# EAGLE design boardV2 (EAGLE 6.4)
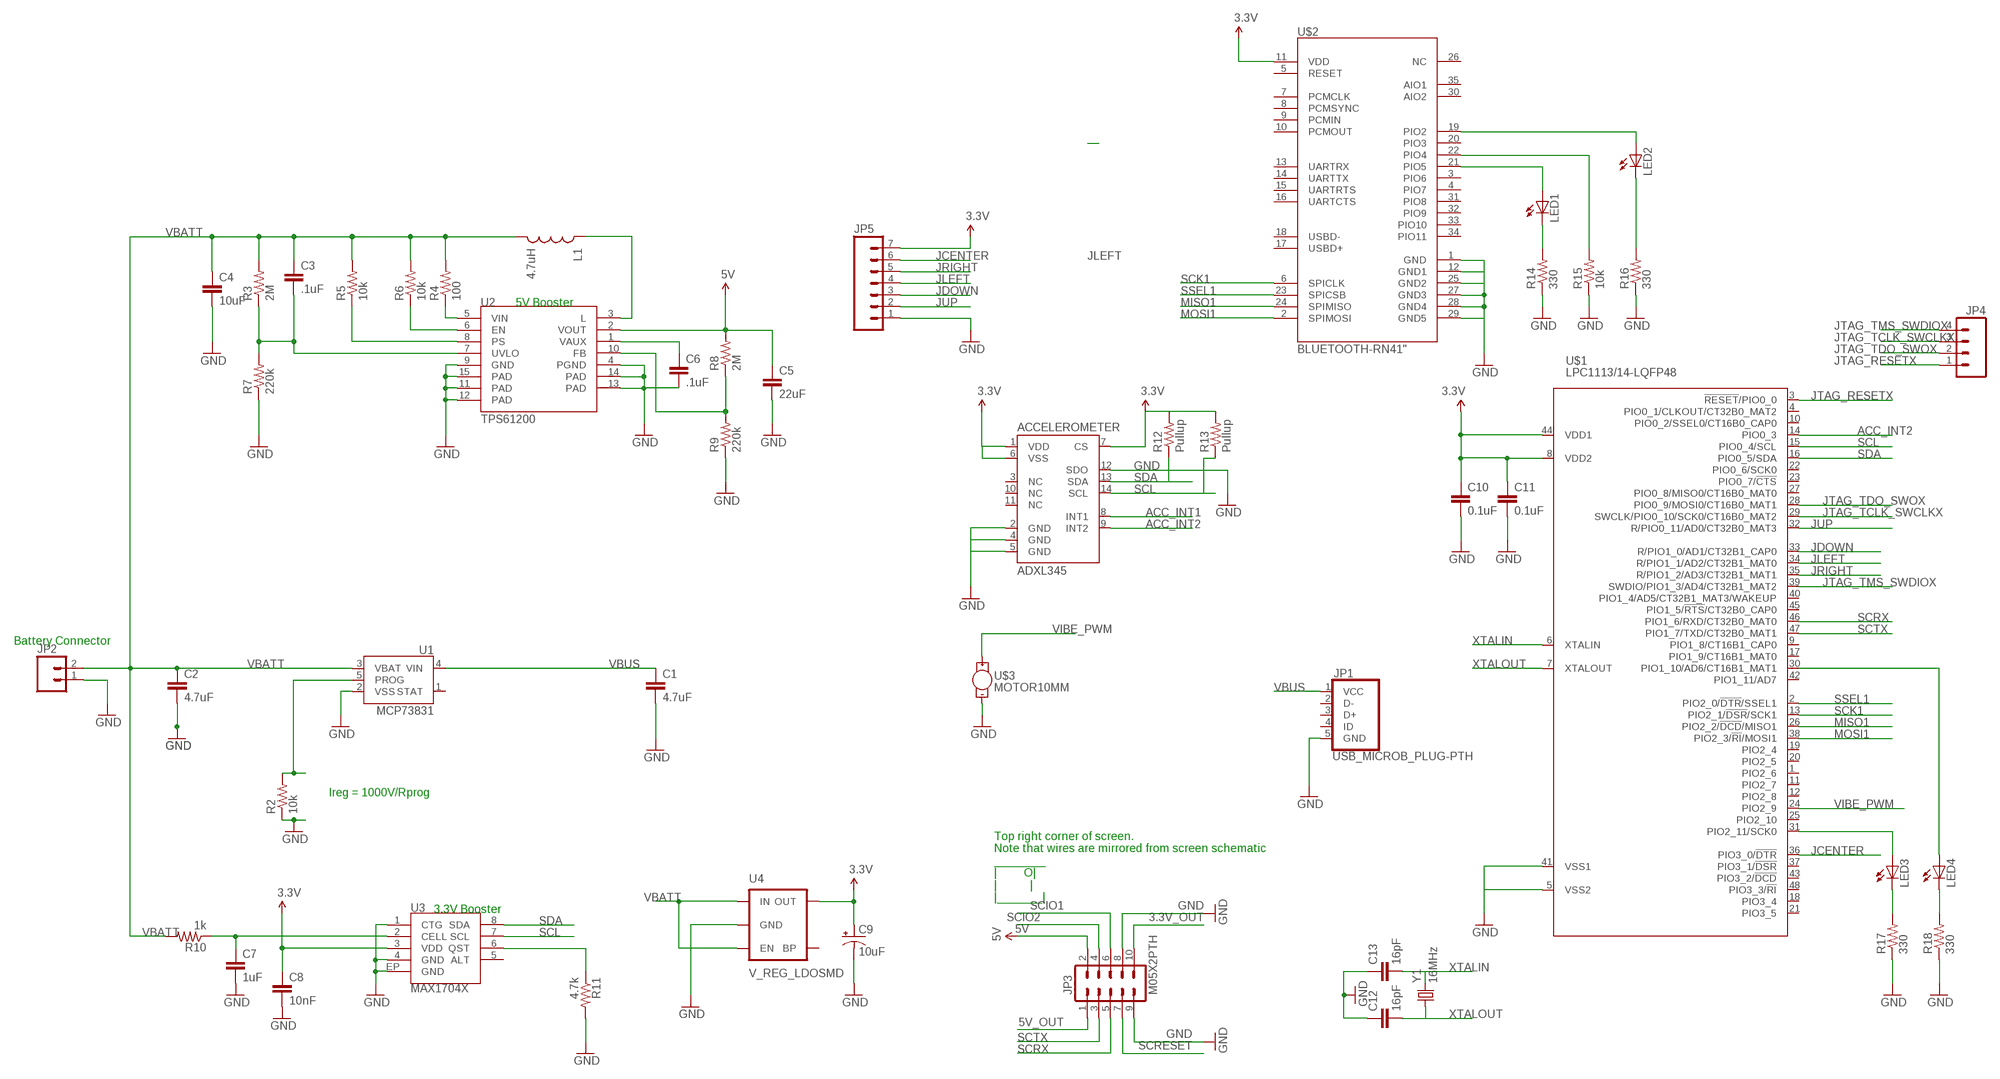
[diagram p0: schematic, sheet 1]

## Parts
ACCELEROMETER  ADXL345  [LGA14]
C1  4.7uF  CAP0402-CAP  [0402-CAP]
C2  4.7uF  CAP0402-CAP  [0402-CAP]
C3  .1uF  CAP0402-CAP  [0402-CAP]
C4  10uF  CAP0402-CAP  [0402-CAP]
C5  22uF  CAP0402-CAP  [0402-CAP]
C6  .1uF  CAP0402-CAP  [0402-CAP]
C7  1uF  CAP0402-CAP  [0402-CAP]
C8  10nF  CAP0402-CAP  [0402-CAP]
C9  10uF  10UF-TANT  [EIA3216]
C10  0.1uF  .1UF-CER  [0402-CAP]
C11  0.1uF  .1UF-CER  [0402-CAP]
C12  16pF  CAP0402-CAP  [0402-CAP]
C13  16pF  CAP0402-CAP  [0402-CAP]
JP1  USB_MICROB_PLUG-PTH  [MICRO-B-RA-TH]
JP2  M02-JST-2-PTH-NO_SILK  [JST-2-PTH-NS]
JP3  M05X2PTH  [AVR_ICSP]
JP4  M04POLAR  [MOLEX-1X4]
JP5  M07  [1X07]
L1  4.7uH  INDUCTOR0402  [C0402]
LED1  LED0603  [LED-0603]
LED2  LED0603  [LED-0603]
LED3  LED0603  [LED-0603]
LED4  LED0603  [LED-0603]
R2  10k  RESISTOR0402-RES  [0402-RES]
R3  2M  RESISTOR0402-RES  [0402-RES]
R4  100  RESISTOR0402-RES  [0402-RES]
R5  10k  RESISTOR0402-RES  [0402-RES]
R6  10k  RESISTOR0402-RES  [0402-RES]
R7  220k  RESISTOR0402-RES  [0402-RES]
R8  2M  RESISTOR0402-RES  [0402-RES]
R9  220k  RESISTOR0402-RES  [0402-RES]
R10  1k  RESISTOR0402-RES  [0402-RES]
R11  4.7k  RESISTOR0402-RES  [0402-RES]
R12  Pullup  RESISTOR0402-RES  [0402-RES]
R13  Pullup  RESISTOR0402-RES  [0402-RES]
R14  330  RESISTOR0402-RES  [0402-RES]
R15  10k  RESISTOR0402-RES  [0402-RES]
R16  330  RESISTOR0402-RES  [0402-RES]
R17  330  RESISTOR0402-RES  [0402-RES]
R18  330  RESISTOR0402-RES  [0402-RES]
U1  MCP73831  [SOT23-5]
U2  TPS61200  [QFN-10_PAD]
U3  MAX1704X  [TDFN-8]
U4  V_REG_LDOSMD  [SOT23-5]
U$1  LPC1113/14-LQFP48  [LQFP48]
U$2  BLUETOOTH-RN41"  [RN41]
U$3  MOTOR10MM  [VIBE-MOTOR-10MM]
Y1  16MHz  CRYSTAL5X3  [CRYSTAL-SMD-5X3]

## Nets
3.3V: ACCELEROMETER.1(VDD) ACCELEROMETER.6(VSS) ACCELEROMETER.7(CS) C8.1 C9.A(+) C10.1 C11.1 JP5.7 R12.2 R13.2 U3.3(VDD) U4.5(OUT) U$1.8(VDD2) U$1.44(VDD1) U$2.11(VDD)
3.3V_OUT: JP3.10
5V: C5.1 JP3.2 R8.2 U2.2(VOUT)
5V_OUT: JP3.1
ACC_INT1: ACCELEROMETER.8(INT1)
ACC_INT2: ACCELEROMETER.9(INT2) U$1.14(PIO0_3)
GND: ACCELEROMETER.2(GND) ACCELEROMETER.4(GND) ACCELEROMETER.5(GND) ACCELEROMETER.12(SDO) C1.2 C2.2 C4.2 C5.2 C6.2 C7.2 C8.2 C9.C(-) C10.2 C11.2 C12.1 C13.1 JP1.5(GND) JP2.1 JP3.8 JP3.9 JP5.1 R2.1 R7.1 R9.1 R11.2 R14.1 R15.1 R16.1 R17.1 R18.1 U1.2(VSS) U2.4(PGND) U2.9(GND) U2.11(PAD) U2.12(PAD) U2.13(PAD) U2.14(PAD) U2.15(PAD) U3.1(CTG) U3.4(GND) U3.EP(GND) U4.2(GND) U$1.5(VSS2) U$1.41(VSS1) U$2.1(GND) U$2.12(GND1) U$2.25(GND2) U$2.27(GND3) U$2.28(GND4) U$2.29(GND5) U$3.-
JCENTER: JP5.6 U$1.36(PIO3_0/!DTR!)
JDOWN: JP5.3 U$1.33(R/PIO1_0/AD1/CT32B1_CAP0)
JLEFT: JP5.4 U$1.34(R/PIO1_1/AD2/CT32B1_MAT0)
JRIGHT: JP5.5 U$1.35(R/PIO1_2/AD3/CT32B1_MAT1)
JTAG_RESETX: JP4.1 U$1.3(!RESET!/PIO0_0)
JTAG_TCLK_SWCLKX: JP4.3 U$1.29(SWCLK/PIO0_10/SCK0/CT16B0_MAT2)
JTAG_TDO_SWOX: JP4.2 U$1.28(PIO0_9/MOSI0/CT16B0_MAT1)
JTAG_TMS_SWDIOX: JP4.4 U$1.39(SWDIO/PIO1_3/AD4/CT32B1_MAT2)
JUP: JP5.2 U$1.32(R/PIO0_11/AD0/CT32B0_MAT3)
MISO1: U$1.26(PIO2_2/!DCD!/MISO1) U$2.24(SPIMISO)
MOSI1: U$1.38(PIO2_3/!RI!/MOSI1) U$2.2(SPIMOSI)
N$1: LED2.A U$2.19(PIO2)
N$2: R2.2 U1.5(PROG)
N$3: C3.2 R3.1 R7.2 U2.7(UVLO)
N$4: C6.1 U2.1(VAUX)
N$5: R6.1 U2.6(EN)
N$6: R5.1 U2.8(PS)
N$7: L1.1 U2.3(L)
N$8: R8.1 R9.2 U2.10(FB)
N$9: C7.1 R10.1 U3.2(CELL)
N$10: R11.1 U3.6(QST)
N$11: R15.2 U$2.22(PIO4)
N$12: LED1.A U$2.21(PIO5)
N$13: LED1.C R14.2
N$14: LED2.C R16.2
N$15: LED3.A U$1.31(PIO2_11/SCK0)
N$16: LED4.A U$1.30(PIO1_10/AD6/CT16B1_MAT1)
N$17: LED3.C R17.2
N$18: LED4.C R18.2
SCIO1: JP3.6
SCIO2: JP3.4
SCK1: U$1.13(PIO2_1/!DSR!/SCK1) U$2.6(SPICLK)
SCL: ACCELEROMETER.14(SCL) R13.1 U3.7(SCL) U$1.15(PIO0_4/SCL)
SCRESET: JP3.7
SCRX: JP3.5 U$1.46(PIO1_6/RXD/CT32B0_MAT0)
SCTX: JP3.3 U$1.47(PIO1_7/TXD/CT32B0_MAT1)
SDA: ACCELEROMETER.13(SDA) R12.1 U3.8(SDA) U$1.16(PIO0_5/SDA)
SSEL1: U$1.2(PIO2_0/!DTR!/SSEL1) U$2.23(SPICSB)
VBATT: C2.1 C3.1 C4.1 JP2.2 L1.2 R3.2 R4.2 R5.2 R6.2 R10.2 U1.3(VBAT) U4.1(IN) U4.3(EN)
VBUS: C1.1 JP1.1(VCC) U1.4(VIN)
VIBE_PWM: U$1.24(PIO2_9) U$3.+
VIN: R4.1 U2.5(VIN)
XTALIN: C13.2 U$1.6(XTALIN) Y1.3
XTALOUT: C12.2 U$1.7(XTALOUT) Y1.1
Unconnected: ACCELEROMETER.3(NC) ACCELEROMETER.10(NC) ACCELEROMETER.11(NC) JP1.2(D-) JP1.3(D+) JP1.4(ID) U1.1(STAT) U3.5(ALT) U4.4(BP) U$1.1(PIO2_6) U$1.4(PIO0_1/CLKOUT/CT32B0_MAT2) U$1.9(PIO1_8/CT16B1_CAP0) U$1.10(PIO0_2/SSEL0/CT16B0_CAP0) U$1.11(PIO2_7) U$1.12(PIO2_8) U$1.17(PIO1_9/CT16B1_MAT0) U$1.18(PIO3_4) U$1.19(PIO2_4) U$1.20(PIO2_5) U$1.21(PIO3_5) U$1.22(PIO0_6/SCK0) U$1.23(PIO0_7/!CTS!) U$1.25(PIO2_10) U$1.27(PIO0_8/MISO0/CT16B0_MAT0) U$1.37(PIO3_1/!DSR!) U$1.40(PIO1_4/AD5/CT32B1_MAT3/WAKEUP) U$1.42(PIO1_11/AD7) U$1.43(PIO3_2/!DCD!) U$1.45(PIO1_5/!RTS!/CT32B0_CAP0) U$1.48(PIO3_3/!RI!) U$2.3(PIO6) U$2.4(PIO7) U$2.5(RESET) U$2.7(PCMCLK) U$2.8(PCMSYNC) U$2.9(PCMIN) U$2.10(PCMOUT) U$2.13(UARTRX) U$2.14(UARTTX) U$2.15(UARTRTS) U$2.16(UARTCTS) U$2.17(USBD+) U$2.18(USBD-) U$2.20(PIO3) U$2.26(NC) U$2.30(AIO2) U$2.31(PIO8) U$2.32(PIO9) U$2.33(PIO10) U$2.34(PIO11) U$2.35(AIO1)

## Notes on the sheet
- 5V Booster
- Battery Connector
- Ireg = 1000V/Rprog
- Top right corner of screen. 
  Note that wires are mirrored from screen schematic
  ________
  |         O|
  |           |
  |_______|
- 3.3V Booster

## Library data of the parts
ACCELEROMETER = SparkFun-Sensors:ADXL345: 3-axis SPI/I2C 2/4/8/16g accelerometer
C1-C8 C12 C13 = SparkFun-Passives:CAP: Capacitor Standard 0603 ceramic capacitor, and 0.1" leaded capacitor.
C9 = SparkFun-Capacitors:10UF-TANT: 10uF Tantalum SMT CAP-00811- 16V 10% (EIA-3216); PROD_ID: CAP-00811
C10 C11 = SparkFun-Capacitors:.1UF-CER: .1uF ceramic SMT CAP-00810- 25V +80%/-20% (0603) CAP-08390- 100V 10% (0603) CAP-08604- 25V 5% (0603); PROD_ID: CAP-00810
JP1 = SparkFun-Connectors:USB_MICROB_PLUG: USB Micro-B Plug Comes in a variety of packages. Check out Hirose's ZX-x0 line: http://www.hirose.co.jp/cataloge_hp/e24200011.pdf
JP2 = SparkFun-Connectors:M02: Header 2 Standard 2-pin 0.1" header. Use with straight break away headers (SKU : PRT-00116), right angle break away headers (PRT-00553), swiss pins (PRT-00743), machine pins (PRT-00117), and female headers (PRT-00115). Molex polarized connector foot print use with SKU : PRT-08233 with associated crimp pins and housings.
JP3 = SparkFun-Connectors:M05X2: Header 5x2 Standard 10-pin dual row 0.1" header. Commonly used with AVR-ISP. Use with Spark Fun Electronics SKU: PRT-00778
JP4 = SparkFun-Connectors:M04: Header 4 Standard 4-pin 0.1" header. Use with straight break away headers (SKU : PRT-00116), right angle break away headers (PRT-00553), swiss pins (PRT-00743), machine pins (PRT-00117), and female headers (PRT-00115). Molex polarized connector foot print use with SKU : PRT-08231 with associated crimp pins and housings. 1MM SMD Version SKU: PRT-10208
JP5 = SparkFun-Connectors:M07: Header 7 Standard 7-pin 0.1" header. Use with straight break away headers (SKU : PRT-00116), right angle break away headers (PRT-00553), swiss pins (PRT-00743), machine pins (PRT-00117), and female headers (PRT-00115). NOTES ON THE VARIANTS LOCK and LOCK_LONGPADS... This footprint was designed to help hold the alignment of a through-hole component (i.e. 7-pin header) while soldering it into place. You may notice that each hole has been shifted either up or down by 0.005 of an inch from it's more standard position (which is usually a perfectly straight line). This slight alteration caused the pins (the squares in the middle) to touch the edges of the holes. Because they are alternating, it causes a "brace" to hold the header in place. 0.005 has proven to be the perfect amount of "off-center" position when using our standard breakaway headers. Although looks a little odd when you look at the bare footprint, once you have a header in there, the alteration is very hard to notice. Also, if you push a header all the way into place, it is covered up entirely on the bottom side. This idea of altering the position of holes to aid alignment will be further integrated into the Sparkfun Library for other footprints. It can help hold any component with 3 or more connection pins.
L1 = SparkFun-Passives:INDUCTOR: Inductors Basic Inductor/Choke - 0603 and 1206. Footprints are not proven and vary greatly between part numbers.
LED1-LED4 = SparkFun-LED:LED: LEDs Standard schematic elements and footprints for 5mm, 3mm, 1206, and 0603 sized LEDs. 5mm - Spark Fun Electronics SKU : COM-00529 (and others)
R2-R18 = SparkFun-Passives:RESISTOR: Resistor Basic schematic elements and footprints for 0603, 1206, and PTH resistors.
U1 = SparkFun-PowerIC:MCP73831: Miniature single cell, fully integrated Li-Ion, Li-polymer charge management controller http://ww1.microchip.com/downloads/en/DeviceDoc/21984a.pdf IC-09995; PROD_ID: IC-09995
U2 = SparkFun-PowerIC:TPS61200: DC to DC Booster IC-10035; PROD_ID: IC-10035
U3 = SparkFun-PowerIC:MAX1704X: MAX17043/MAX17044: Battery Fuel Guage (43 is 1cell, 44 is 2cell)
U4 = SparkFun-PowerIC:V_REG_LDO: Voltage Regulator LDO Standard 150mA LDO voltage regulator in SOT-23 layout. Micrel part MIC5205. BP (by-pass) pin is used to lower output noise with 470pF cap.
U$1 = lpc1100v1.1:LPC1113/14-LQFP48: NXP Semiconductors LPC11xx microcontrollers <http://ics.nxp.com/products/lpc1000/lpc11xx/> ARM 32-bit Cortex-M0 Microcontroller with MPU CPU clock up to 50MHz Up to 32KByte on-chip Flash ROM with In-System Programming (ISP) and In-Application Programming (IAP) via On-Chip Bootloader Up to 8KByte SRAM Nested Vectored Interrupt Controller Up to 2 SPI controllers UART with full Modem Interface and RS485 Support Fast Mode I2C-Bus 4 Timers with 4 capture channels and 13 output channels Watchdog (WDT) Sytem tick timer 10-bit ADC with 8 channels Power Management Unit (PMU) Brownout detection 12MHz internal RC oscillator Serial Wire Debug/Trace port
U$2 = SparkFun-RF:BLUETOOTH-RN41: Bluetooth SMD module
U$3 = SparkFun-Electromechanical:MOTOR: Vibration Motor- ROB-08449 Physical dimension and wire connections for this powerful vibration motor. Motor has a self adhesive backing.
Y1 = SparkFun-FreqCtrl:CRYSTAL: Various standard crystals. Proven footprints. Spark Fun Electronics SKU : COM-00534

## Board
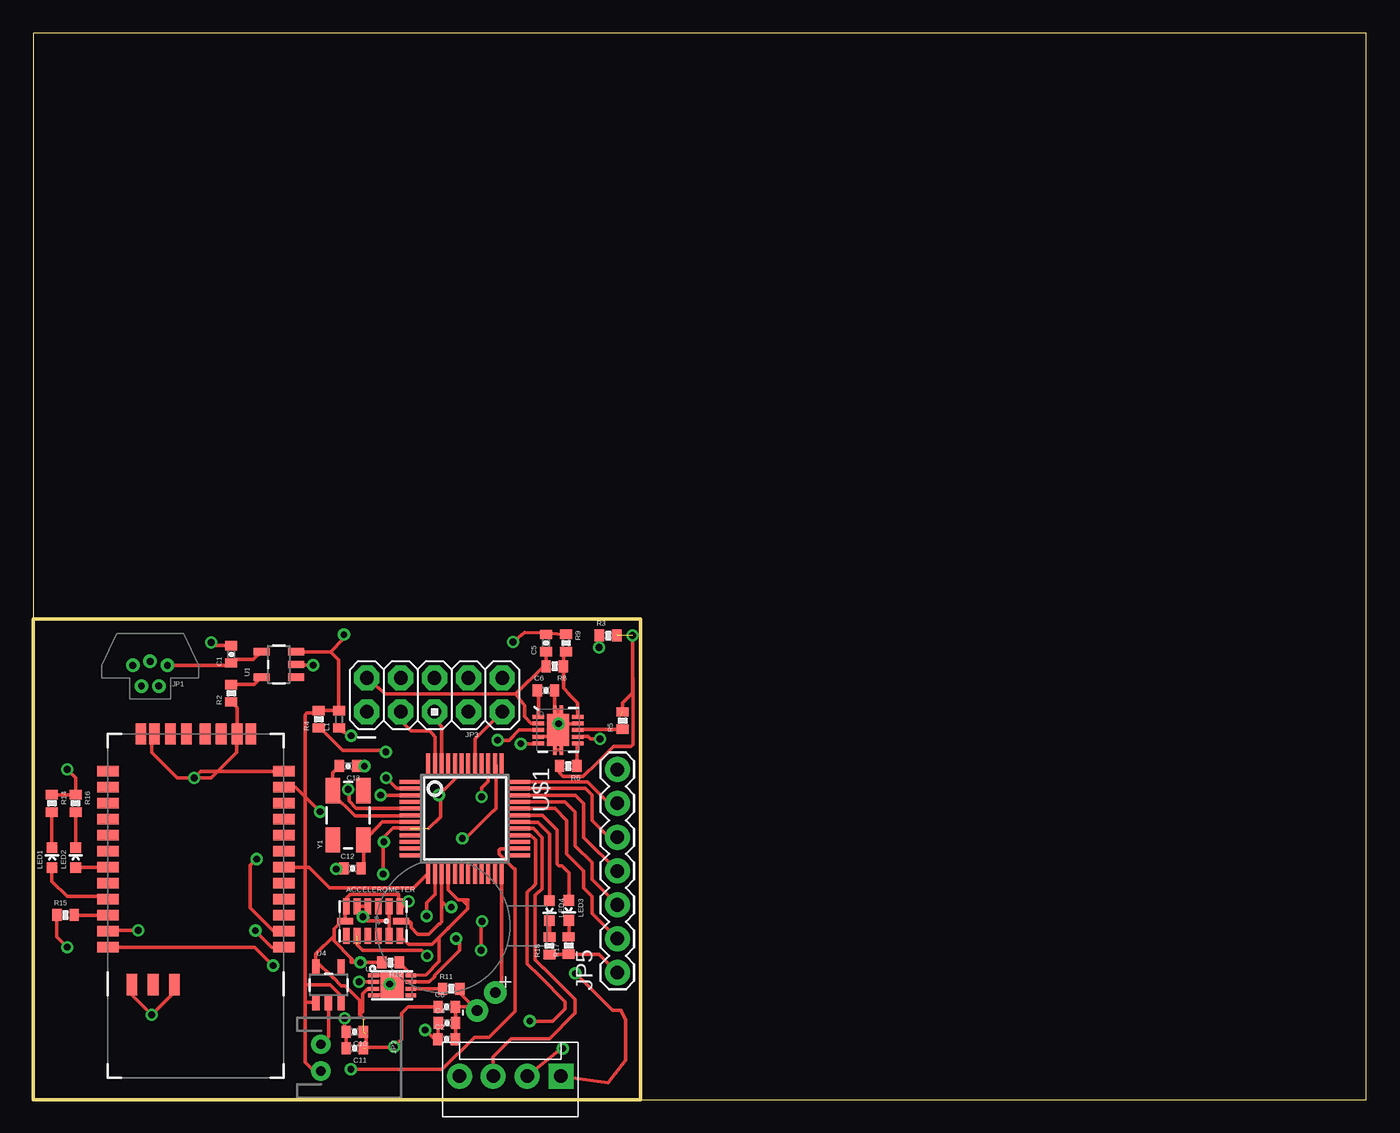
[diagram p1: board, top side]
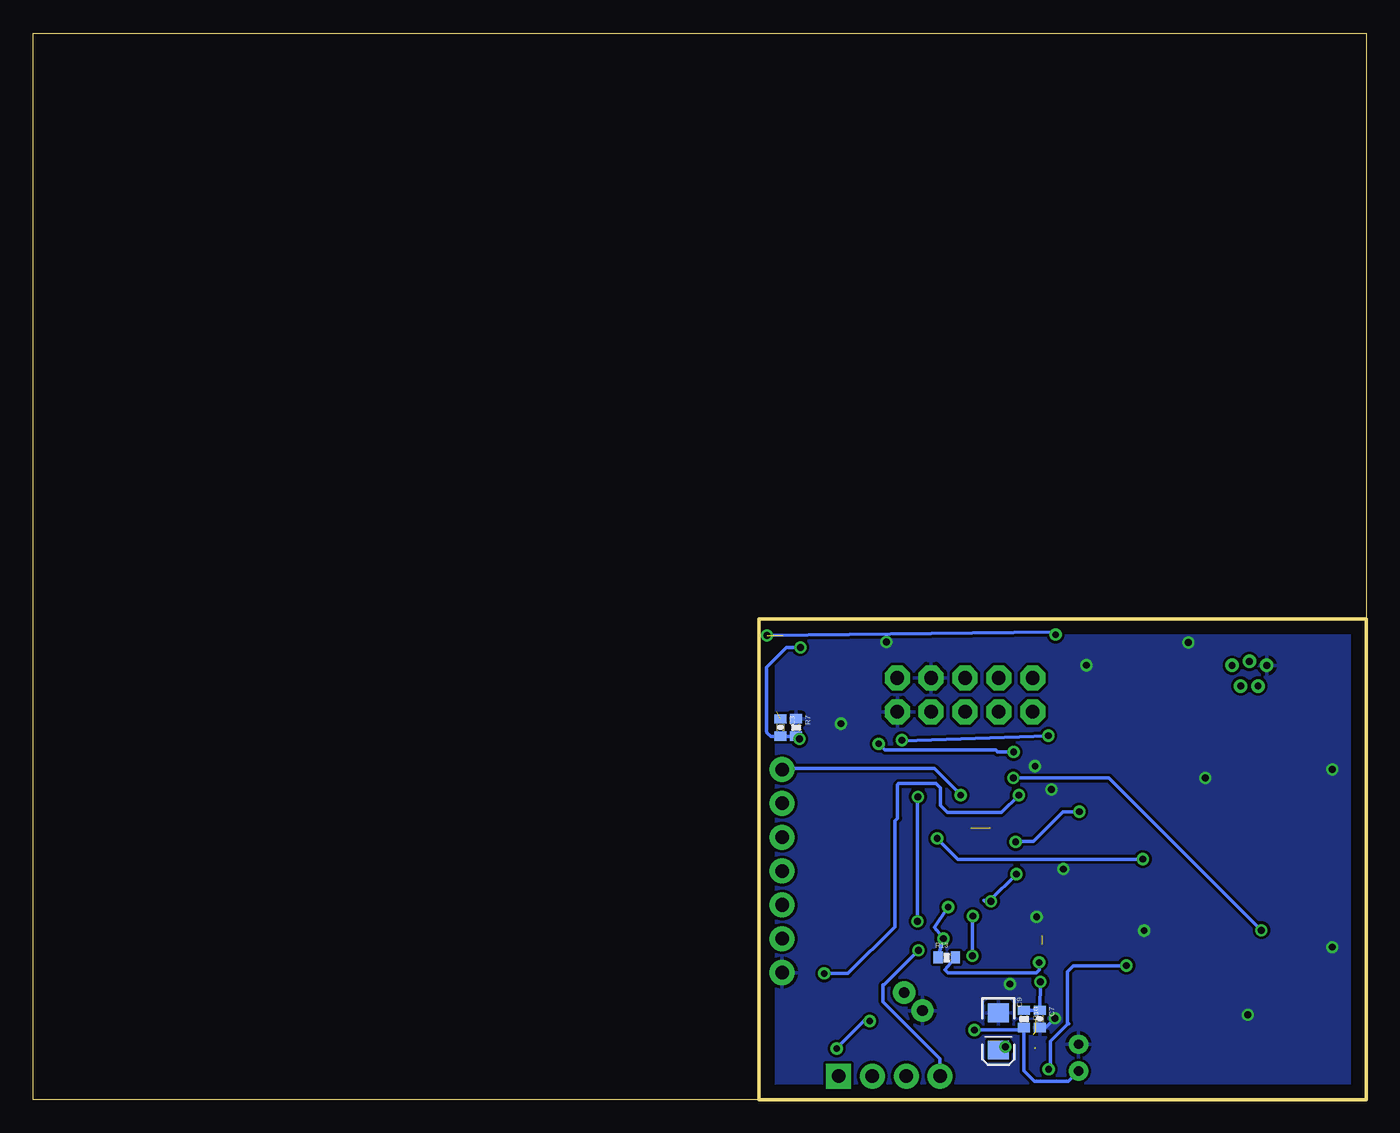
[diagram p2: board, bottom side, seen from below]

Size 100 x 80 mm. Coordinates in mm from the lower left corner, seen from the top.
Outline: 45.56,0 100,0 100,80 0,80 0,36.07
Outline: 0,36.07 0,0 45.56,0
Outline: 45.56,0 45.56,36.07 0,36.07
Copper layers (1*16): Top 0.035mm / dielectric 1.5mm / Bottom 0.035mm
Design rules "default": minimum track width 10mil, minimum drill 24mil, track to track 8mil, track to pad 8mil, pad to pad 8mil, via to via 8mil, smd to smd 8mil, copper to edge 40mil, drill to drill 8mil, minimum pad ring 10mil, minimum via ring 8mil, stop-mask expansion 4mil, vias tented up to drill 0mil, thermal gap 10mil

### Footprints (pad centres in the part's own frame; a part is rotated, then mirrored left to right if it is on the bottom)
LGA14 = smd 0.5 x 1.2: 1 2,1.1; 2 1.2,1.1; 3 0.4,1.1; 4 -0.4,1.1; 5 -1.2,1.1; 6 -2,1.1; 8 -2,-1.1; 9 -1.2,-1.1; 10 -0.4,-1.1; 11 0.4,-1.1; 12 1.2,-1.1; 13 2,-1.1 | smd 1.2 x 0.5: 7 -2.1,0; 14 2.1,0
0402-CAP = smd 0.7 x 0.9: 1 -0.65,0; 2 0.65,0
EIA3216 = smd 1.4 x 1.6: A 1.4,0; C -1.4,0
MICRO-B-RA-TH = drill 0.508 pad 0.9: 1 -1.3,-0.95; 2 -0.65,0.6; 3 0,-1.25; 4 0.65,0.6; 5 1.3,-0.95
JST-2-PTH-NS = drill 0.7 pad 1.448: 1 -1,0; 2 1,0
AVR_ICSP = drill 1.016 pad 1.88 octagon: 1 -1.27,5.08; 2 1.27,5.08; 3 -1.27,2.54; 4 1.27,2.54; 5 -1.27,0; 6 1.27,0; 7 -1.27,-2.54; 8 1.27,-2.54; 9 -1.27,-5.08; 10 1.27,-5.08
MOLEX-1X4 = drill 1.016 pad 1.88 square: 1 0,0 | drill 1.016 pad 1.88: 2 2.54,0; 3 5.08,0; 4 7.62,0
1X07 = drill 1.016 pad 1.88: 1 0,0; 2 2.54,0; 3 5.08,0; 4 7.62,0; 5 10.16,0; 6 12.7,0; 7 15.24,0
C0402 = smd 0.7 x 0.9: 1 -0.65,0; 2 0.65,0
LED-0603 = smd 0.8 x 0.8: A 0,-0.75; C 0,0.75
0402-RES = smd 0.7 x 0.9: 1 -0.65,0; 2 0.65,0
SOT23-5 = smd 0.55 x 1.2: 1 -0.95,-1.3; 2 0,-1.3; 3 0.95,-1.3; 4 0.95,1.3; 5 -0.95,1.3
QFN-10_PAD = smd 0.297 x 0.85: 1 -1,-1.475; 2 -0.5,-1.475; 3 0,-1.475; 4 0.5,-1.475; 5 1,-1.475; 6 1,1.475; 7 0.5,1.475; 8 0,1.475; 9 -0.5,1.475; 10 -1,1.475 | smd 0.7 x 0.28: 11 -1.5,0.25; 12 -1.5,-0.25; 13 1.5,0.25; 14 1.5,-0.25 | smd 2.4 x 1.65: 15 0,0
TDFN-8 = smd 0.8 x 0.3: 1 -1.4,0.75; 2 -1.4,0.25; 3 -1.4,-0.25; 4 -1.4,-0.75; 5 1.4,-0.75; 6 1.4,-0.25; 7 1.4,0.25; 8 1.4,0.75 | smd 1.73 x 1.88: EP 0,0
LQFP48 = smd 0.3 x 1.6: 1 -2.75,-4.1; 2 -2.25,-4.1; 3 -1.75,-4.1; 4 -1.25,-4.1; 5 -0.75,-4.1; 6 -0.25,-4.1; 7 0.25,-4.1; 8 0.75,-4.1; 9 1.25,-4.1; 10 1.75,-4.1; 11 2.25,-4.1; 12 2.75,-4.1; 25 2.75,4.1; 26 2.25,4.1; 27 1.75,4.1; 28 1.25,4.1; 29 0.75,4.1; 30 0.25,4.1; 31 -0.25,4.1; 32 -0.75,4.1; 33 -1.25,4.1; 34 -1.75,4.1; 35 -2.25,4.1; 36 -2.75,4.1 | smd 1.6 x 0.3: 13 4.1,-2.75; 14 4.1,-2.25; 15 4.1,-1.75; 16 4.1,-1.25; 17 4.1,-0.75; 18 4.1,-0.25; 19 4.1,0.25; 20 4.1,0.75; 21 4.1,1.25; 22 4.1,1.75; 23 4.1,2.25; 24 4.1,2.75; 37 -4.1,2.75; 38 -4.1,2.25; 39 -4.1,1.75; 40 -4.1,1.25; 41 -4.1,0.75; 42 -4.1,0.25; 43 -4.1,-0.25; 44 -4.1,-0.75; 45 -4.1,-1.25; 46 -4.1,-1.75; 47 -4.1,-2.25; 48 -4.1,-2.75
RN41 = smd 0.8 x 1.6: 1 -6.6,-6.6; 2 -5.4,-6.6; 3 -4.2,-6.6; 4 -3,-6.6; 5 -1.8,-6.6; 6 -0.6,-6.6; 7 0.6,-6.6; 8 1.8,-6.6; 9 3,-6.6; 10 4.2,-6.6; 11 5.4,-6.6; 12 6.6,-6.6; 13 6.6,6.6; 14 5.4,6.6; 15 4.2,6.6; 16 3,6.6; 17 1.8,6.6; 18 0.6,6.6; 19 -0.6,6.6; 20 -1.8,6.6; 21 -3,6.6; 22 -4.2,6.6; 23 -5.4,6.6; 24 -6.6,6.6 | smd 1.6 x 0.8: 25 -9.4,4.8; 26 -9.4,3.2; 27 -9.4,1.6; 28 9.4,3.1; 29 9.4,-3.1; 30 9.4,-4.122; 31 9.4,-1.9; 32 9.4,-0.7; 33 9.4,0.7; 34 9.4,1.9; 35 9.4,4.122
VIBE-MOTOR-10MM = drill 0.8 pad 1.676: + -5,-3.9; - -6.35,-2.54
CRYSTAL-SMD-5X3 = smd 1.9 x 1.1: 1 -1.85,-1.15; 2 1.85,-1.15; 3 1.85,1.15; 4 -1.85,1.15

### Placement (x,y rotation side)
ACCELEROMETER  25.5,13.38 0 top
C1  14.86,33.4 90 top
C2  31.01,4.51 0 top
C3  43.95,27.9 270 bottom
C4  31.03,5.74 0 top
C5  38.46,34.25 90 top
C6  38.46,30.7 0 top
C7  24.48,6.05 270 bottom
C8  31.02,6.95 0 top
C9  27.59,5.11 270 bottom
C10  24.12,5.09 180 top
C11  24.12,3.84 180 top
C12  23.94,17.34 0 top
C13  23.62,25.02 180 top
JP1  8.76,31.62 180 top
JP2  21.58,3.14 270 top
JP3  30.1,30.36 90 top
JP4  39.59,1.75 180 top
JP5  43.81,9.53 90 top
L1  22.93,28.53 90 top
LED1  1.4,18.16 0 top
LED2  3.17,18.16 0 top
LED3  40.18,14.2 180 top
LED4  38.72,14.18 180 top
R2  14.86,30.48 90 top
R3  43.12,34.82 0 top
R4  21.42,28.53 90 top
R5  44.21,28.44 90 top
R6  40.13,25.03 180 top
R7  42.78,27.91 270 bottom
R8  39.12,32.51 180 top
R9  39.97,34.26 270 top
R10  25.67,6.05 270 bottom
R11  31.35,8.31 0 top
R12  26.81,10.28 180 top
R13  31.47,10.65 0 bottom
R14  1.4,22.23 270 top
R15  2.41,13.84 0 top
R16  3.17,22.23 270 top
R17  40.16,11.56 90 top
R18  38.73,11.53 90 top
U1  18.41,32.64 90 top
U2  39.37,27.72 270 top
U3  26.93,8.57 0 top
U4  22.15,8.6 0 top
U$1  32.38,21.08 270 top
U$2  12.19,18.03 90 top
U$3  30.75,13.02 90 top
Y1  23.62,21.34 90 top

### Tracks (layer width: path | path; a pad name or v marks a point on that pad's centre or on a via)
3.3V  (via drill 0.51)  (5 unrouted)
  Top 0.254: U$1.44 31.64,24.05 v30.42,22.83 30.54,22.71 30.54,21.21 29.66,20.33 | U$2.11 19.69,23.43 v21.53,21.6 | 28.23,20.39 27,20.39 26.3,19.68 v26.3,19.33 26.24,19.27 v26.24,16.91 | v28.15,14.88 27.75,14.48 ACCELEROMETER.1 27.39,14.59 27.39,15.38 27.36,15.41 23.77,15.41 23.5,15.14 ACCELEROMETER.6 23.4,14.38 ACCELEROMETER.7 23.12,13.38 22.56,12.82 22.56,12.29 | 22.56,12.29 22.56,11.9 23.85,10.61 | 23.85,10.61 23.85,10.28 | R12.2 v24.53,10.28 | v24.53,10.28 23.85,10.28 | 23.85,10.28 | U4.5 21.2,10.42 | 21.2,10.42 21.2,10.92 22.56,12.29 | v24.53,10.28 24.18,10.28 23.85,10.61 | U3.3 25.1,8.32 24.71,7.92 24.71,6.6 24.47,6.36 | 24.89,3.84 24.97,3.92 | 24.97,3.92 24.97,4.88 | 24.77,6.06 24.47,6.36 | 24.97,3.92 27.03,3.92 v27.06,3.95 27.62,4.51 27.62,6.45 28.12,6.95 C8.1 | 24.47,6.36 24.47,7.44 23.79,8.13 | 23.79,8.13 | 23.79,8.13 23.38,8.54 23.11,8.54 22.52,9.13 22.49,9.13 21.2,10.42
  Bottom 0.254: v30.42,22.83 30.42,22.86 32.39,24.84 43.74,24.84 JP5.7 | v21.53,21.6 22.76,21.6 24.97,19.39 26.24,19.39 v26.3,19.33 | v28.15,14.88 28.62,14.88 28.68,14.94 28.21,14.94 v26.24,16.91 | R13.2 31.62,9.74 31.39,9.52 24.74,9.52 24.53,9.72 v24.53,10.28 | v27.06,3.95 27.35,3.95 C9.A
5V
  Top 0.254: U2.2 37.35,28.22 36.84,28.73 36.84,29.55 36.16,30.42 | 36.16,30.42 26.42,30.42 JP3.2 | C5.1 38.47,33.79 R8.2 38.27,32.51 36.16,30.42
ACC_INT2  (via drill 0.51)  (1 unrouted)
  Top 0.254: v29.51,13.76 29.51,14.76 30.13,15.38 U$1.14 | 24.3,11.63 24.3,11.61 24.58,11.32 | 24.58,11.32 | 24.58,11.32 24.7,11.2 29.12,11.2 v29.54,10.78
  Bottom 0.254: v29.54,10.78 29.54,13.73 v29.51,13.76
GND  (via drill 0.51)
  Top 0.254: ACCELEROMETER.4 ACCELEROMETER.5 24.3,14.13 v24.73,13.7 25.02,13.4 26.71,13.4 26.7,13.42 ACCELEROMETER.2 ACCELEROMETER.12 | R14.1 R16.1 3.17,24.13 v2.54,24.77 | R15.1 1.76,12.21 v2.54,11.43 | U$2.25 7.39,7.85 v8.89,6.35 10.79,8.26 10.79,8.43 U$2.27 | v12.06,24.13 10.79,24.13 8.89,26.04 8.89,27.23 U$2.28 | v12.06,24.13 13.34,24.13 15.24,26.04 15.24,27.38 U$2.29 15.29,29.4 R2.1 | U$2.12 12.57,24.63 v12.06,24.13 | C1.2 13.57,34.05 v13.34,34.29 | C13.1 v24.84,25.02 v24.85,25.01 | v22.73,17.3 22.62,17.3 22.59,17.27 23.22,17.27 C12.1 | U$1.41 33.13,27.05 JP3.9 | U2.15 39.37,28.16 v39.4,28.2 | U2.15 39.63,27.72 40.11,28.2 40.82,28.2 U2.9 | v39.4,28.2 39.4,29 U2.11 U2.12 C6.2 | U2.15 39.25,27.72 38.78,27.25 37.93,27.25 U2.4 | U2.13 U2.14 39.52,26.22 39.61,26.13 39.61,27.99 v39.4,28.2 | v20.99,32.59 19.76,32.59 U1.2 | R9.1 38.09,35 | 38.09,35 C5.2 | 38.09,35 36.85,35.02 v35.99,34.32 | R18.1 38.76,10.91 R17.1 42.43,10.91 JP5.1 | U$1.5 24.5,21.83 24.47,21.86 24.21,21.86 23.68,22.39 23.68,23.22 v23.62,23.27 | U$2.1 17.89,11.43 v16.66,12.67 | U3.1 26.01,9.38 U3.EP | U3.EP 26.01,7.88 U3.4 26.01,7.82 26.8,8.6 | U3.EP 26.76,8.64 v26.74,8.66 | U4.2 22.15,4.71 JP2.1 | R11.2 32,7.96 U$3.- 33.02,6.95 C8.2 31.67,5.75 C4.2 31.68,4.53 C2.2 | C11.2 C10.2 23.35,5.21 v23.35,6.1 | C11.2
  Bottom 0.254: C7.2 24.05,5.4 v23.35,6.1 | U$3.- 33.34,6.72
  pour Bottom: 0,0 43.18,0 44.45,1.27 44.45,34.29 43.18,35.56 1.27,35.56 0,34.29
JCENTER
  Top 0.254: U$1.36 41.57,23.83 43.18,22.23 JP5.6
JDOWN
  Top 0.254: U$1.33 39.9,22.33 40.64,21.59 40.64,19.05 41.91,17.78 41.91,16.51 JP5.3
JLEFT
  Top 0.254: U$1.34 40.67,22.83 41.27,22.23 41.27,19.68 JP5.4
JRIGHT
  Top 0.254: U$1.35 41.44,23.33 41.91,22.86 41.91,20.95 43.18,19.68 JP5.5
JTAG_RESETX  (via drill 0.51)
  Top 0.254: JP4.1 43.11,1.26 44.44,2.95 44.44,5.98 44.09,6.69 43.44,6.69 v40.67,9.46 | v26.06,22.83 U$1.3
  Bottom 0.254: v40.67,9.46 38.87,9.46 35.37,12.96 35.37,20.89 35.16,21.09 35.16,23.62 35.08,23.7 32.3,23.7 31.96,23.37 31.96,22.07 31.41,21.53 27.37,21.53 v26.06,22.83
JTAG_TCLK_SWCLKX
  Top 0.254: U$1.29 37.52,20.33 38.17,19.68 38.17,15.82 37.93,15.59 37.9,15.59 37.64,15.32 37.64,10.49 38.25,9.87 38.28,9.87 40.64,7.51 40.64,6.45 40.61,6.45 38.73,4.57 35.84,4.57 34.48,3.21 34.48,1.3 JP4.3
JTAG_TDO_SWOX  (via drill 0.51)
  Top 0.254: U$1.28 37.31,19.83 37.66,19.47 37.66,16.18 37.61,16.12 37.61,16.09 37.05,15.53 37.05,10.19 38.05,9.19 39.9,7.34 39.9,6.8 38.96,5.86 37.28,5.86 v37.25,5.89 | v39.73,3.83 39.63,3.83 JP4.2
  Bottom 0.254: v37.25,5.89 37.66,5.89 v39.73,3.83
JTAG_TMS_SWDIOX  (via drill 0.51)
  Top 0.254: v33.6,11.2 33.6,13.32 v33.66,13.38 | v33.63,22.71 33.63,23.39 34.1,23.86 34.1,25.15 U$1.39
  Bottom 0.254: JP4.4 31.98,3.07 36.25,7.34 36.25,8.6 36.19,8.6 v33.6,11.2 | v33.66,13.38 33.66,22.69 v33.63,22.71
JUP
  Top 0.254: U$1.32 39.13,21.83 40.01,20.95 40.01,18.41 41.27,17.14 41.27,15.88 41.91,15.24 41.91,13.97 JP5.2
MISO1  (via drill 0.51)
  Top 0.254: U$2.24 16.61,11.43 v17.99,10.05 | v23.82,2.27 30.68,2.27 33.1,4.68 34.19,4.68 36.13,6.63 36.13,17.32 36.08,17.32 34.96,18.44 34.96,18.74 35.02,18.8 36.45,18.8 U$1.26
  Bottom 0.254: v17.99,10.05 21.94,10.05 21.97,10.02 | 21.97,10.02 | 21.97,10.02 22.41,9.57 22.41,5.78 22.32,5.69 22.38,5.69 23.71,4.36 23.71,2.39 v23.82,2.27
MOSI1  (via drill 0.51)
  Top 0.254: U$2.2 18.03,12.63 16.29,14.38 16.29,17.56 v16.76,18.03 | v32.19,19.59 32.42,19.59 34.45,21.62 34.48,21.62 34.72,21.86 34.72,25.1 U$1.38
  Bottom 0.254: v16.76,18.03 30.63,18.03 v32.19,19.59
N$1
  Top 0.254: U$2.19 3.2,17.43 LED2.A
N$2
  Top 0.254: R2.2 16.56,31.13 U1.5
N$3  (via drill 0.51)
  Top 0.254: v42.52,27.05 41.82,27.05 41.61,27.25 40.88,27.25 U2.7 | R3.1 42.46,34.48 v42.45,33.93
  Bottom 0.254: C3.2 R7.2 | C3.2 42.73,27.25 v42.52,27.05 | C3.2 44.67,27.25 44.94,27.52 44.94,27.55 45,27.61 45,32.41 43.48,33.93 v42.45,33.93
N$4
  Top 0.254: U2.1 37.9,30.61 C6.1
N$5
  Top 0.254: R6.1 40.78,26.66 U2.6
N$6
  Top 0.254: R5.1 40.91,27.79 U2.8
N$7  (via drill 0.51)
  Top 0.254: L1.1 22.93,27.74 v23.85,27.3 | v34.84,26.96 35.69,26.96 36.46,27.72 U2.3
  Bottom 0.254: v23.85,27.3 34.78,26.9 v34.84,26.96
N$8
  Top 0.254: U2.10 40.85,29.76 40.2,30.41 40.2,30.43 39.77,30.87 R8.1 39.77,33.67 R9.2
N$9  (via drill 0.51)
  Top 0.254: U3.2 24.63,8.82 v24.44,8.84
  Bottom 0.254: R10.1 C7.1 v24.44,8.84
N$10
  Top 0.254: R11.1 28.34,8.31 U3.6
N$11
  Top 0.254: U$2.22 3.07,13.83 R15.2
N$12
  Top 0.254: LED1.A 1.4,16.38 2.54,15.24 5.39,15.24 U$2.21
N$13
  Top 0.254: LED1.C R14.2
N$14
  Top 0.254: LED2.C R16.2
N$15
  Top 0.254: LED3.A 40.18,17.02 39.67,17.53 39.43,17.53 39.28,17.68 39.28,20.24 38.2,21.33 U$1.31
N$16
  Top 0.254: LED4.A 38.72,19.95 37.87,20.8 36.52,20.8 U$1.30
N$17
  Top 0.254: LED3.C 40.18,12.22 R17.2
N$18
  Top 0.254: LED4.C R18.2
SCK1
  Top 0.254: U$2.6 20.68,17.43 22.23,15.88 28.53,15.88 U$1.13
SCL  (via drill 0.51)
  Top 0.254: 30.64,14.88 30.64,13.32 30.51,13.2 30.45,13.2 29.66,12.4 28.83,12.4 28.33,12.9 28.33,13.27 28.28,13.32 27.65,13.32 ACCELEROMETER.14 | 30.64,14.88 30.64,16.43 30.6,16.47 30.6,16.95 U$1.15 | v31.36,14.44 31.08,14.44 30.64,14.88 | U3.7 29.69,8.82 30.1,9.22 30.1,9.33 31.97,11.2 31.97,11.83 v31.72,12.08
  Bottom 0.254: v31.36,14.44 32.39,12.94 v31.72,12.08 R13.1
SCRX
  Top 0.254: JP3.5 30.1,28.52 30.63,27.99 U$1.46
SCTX
  Top 0.254: U$1.47 30.14,27.21 30.04,27.31 30.04,27.34 29.71,27.66 28.33,27.66 27.56,28.43 JP3.3
SDA
  Top 0.254: 31.14,12.87 31.16,12.85 | 31.16,12.85 31.13,12.85 30.45,12.17 | 30.45,12.17 29.92,11.64 28.14,11.64 ACCELEROMETER.13 | 31.16,12.85 31.16,12.88 32.57,14.29 32.57,14.58 | 32.57,14.58 32.57,14.97 32.6,15 31.86,15 31.13,15.73 U$1.16 | 32.57,14.58 32.34,14.82 32.34,14.91 32.28,14.97 32.31,14.97 | 30.45,12.17 30.45,10.37 29.45,9.38 U3.8 28.16,9.58 R12.1
SSEL1  (via drill 0.51)
  Top 0.254: U$1.2 27.27,23.33 v26.48,24.13 | v7.86,12.7 5.66,12.7 U$2.23
  Bottom 0.254: v26.48,24.13 19.29,24.13 v7.86,12.7
VBATT  (via drill 0.51)  (2 unrouted)
  Top 0.254: U1.3 22.29,33.59 | 22.29,33.59 22.91,32.97 22.91,29.2 L1.2 R4.2 21.23,28.99 20.5,28.99 20.38,28.87 20.38,8.52 | R5.2 44.21,29.76 44.97,30.52 44.97,31.64 | 44.97,31.64 44.97,34.97 v44.95,34.82 | v23.29,34.88 23.29,34.59 22.29,33.59 | R6.2 39.48,24.49 39.73,24.25 41.26,24.25 42.32,25.31 42.35,25.31 43.53,26.49 44.85,26.49 45,26.63 45,31.61 44.97,31.64 | JP2.2 21.04,2.14 20.38,2.8 20.38,7.19 | 20.38,7.19 20.38,8.52 | U4.1 20.49,7.3 20.38,7.19 | U4.3 23.1,7.77 22.26,8.6 20.47,8.6 20.38,8.52 | C4.1 30.38,4.53 C2.1 30.09,4.51 v29.39,5.21
  Bottom 0.254: v44.95,34.82 23.35,35.09 v23.29,34.88 | JP2.2 22.36,1.35 24.89,1.35 25.67,2.14 R10.2 25.85,5.21 v29.39,5.21
VBUS
  Top 0.254: JP1.1 14.68,32.57 C1.1 15.13,33.02 16.51,33.02 17.08,33.59 U1.4
VIBE_PWM
  Top 0.254: U$1.24 35.13,8.5 U$3.+
VIN  (via drill 0.51)
  Top 0.254: R4.1 21.52,27.88 23.21,26.19 26.33,26.19 v26.45,26.07 | v36.58,26.69 37.87,26.69 U2.5
  Bottom 0.254: v26.45,26.07 27.65,26.07 27.8,26.22 36.1,26.22 v36.58,26.69
XTALIN
  Top 0.254: C13.2 22.47,24.52 Y1.3 22.47,22.93 24.13,21.27 28.23,21.27 U$1.6
XTALOUT
  Top 0.254: U$1.7 26.18,20.83 26.04,20.68 26.04,20.64 24.88,19.49 Y1.1 24.77,17.52 C12.2